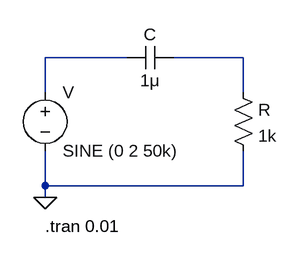
[diagram p0: schematic ερωτήματα 9-11.asc]
ερωτήματα 9-11.asc, the LTspice schematic file:
Version 4
SHEET 1 880 680
WIRE 160 80 48 80
WIRE 320 80 224 80
WIRE 48 128 48 80
WIRE 320 128 320 80
WIRE 48 256 48 208
WIRE 320 256 320 208
WIRE 320 256 48 256
WIRE 48 272 48 256
FLAG 48 272 0
SYMBOL voltage 48 112 R0
SYMATTR InstName V
SYMATTR Value SINE (0 2 50k)
SYMBOL cap 224 64 R90
WINDOW 0 0 32 VBottom 2
WINDOW 3 32 32 VTop 2
SYMATTR InstName C
SYMATTR Value 1μ
SYMBOL res 304 112 R0
SYMATTR InstName R
SYMATTR Value 1k
TEXT 48 312 Left 2 !.tran 0.01

The netlist it stands for:
* ερωτήματα 9-11.asc
V N001 0 SINE (0 2 50k)
C N002 N001 1μ
R N002 0 1k
.tran 0.01
.backanno
.end